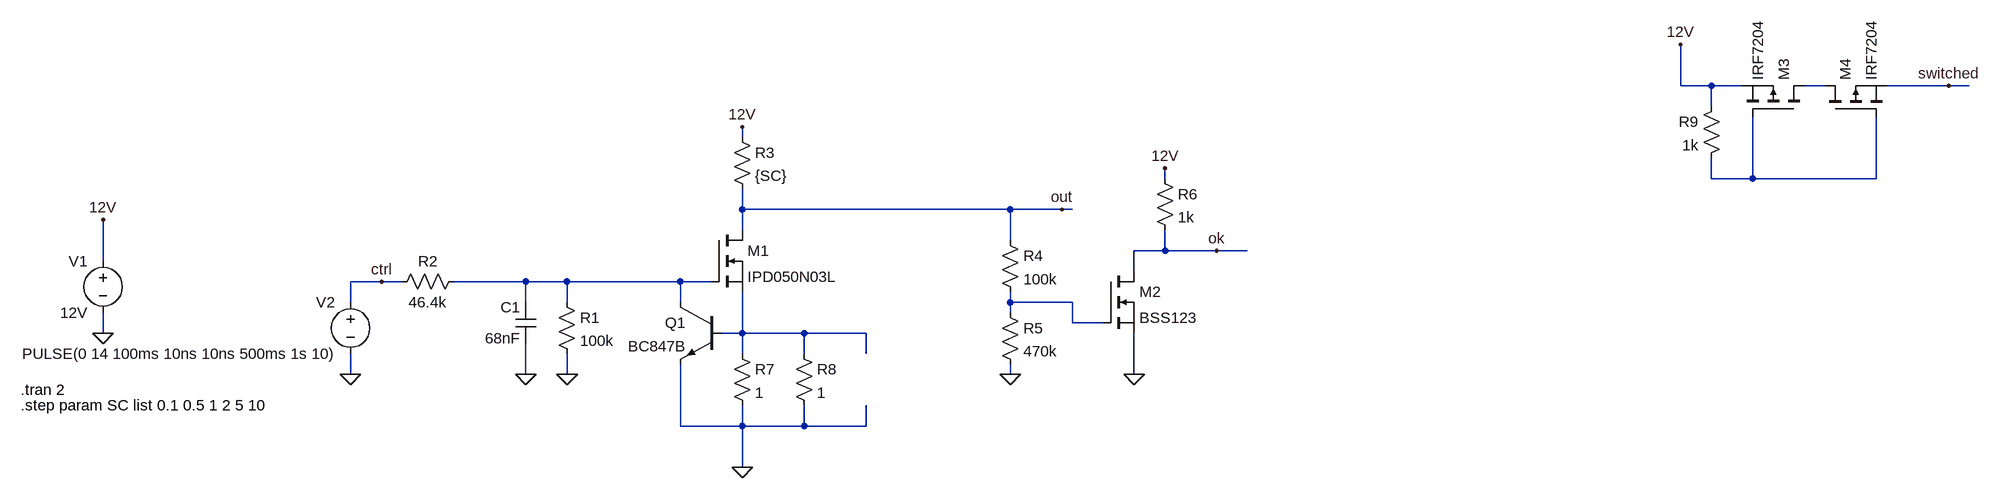
[diagram p0: schematic Current Regulation.asc]
Current Regulation.asc, the LTspice schematic file:
Version 4
SHEET 1 3156 680
WIRE 2672 -128 2672 -192
WIRE 2720 -128 2672 -128
WIRE 2768 -128 2720 -128
WIRE 2896 -128 2864 -128
WIRE 3088 -128 2992 -128
WIRE 3120 -128 3088 -128
WIRE 2720 -96 2720 -128
WIRE 1216 -48 1216 -64
WIRE 1872 16 1872 0
WIRE 2720 16 2720 -16
WIRE 2784 16 2784 -80
WIRE 2784 16 2720 16
WIRE 2976 16 2976 -80
WIRE 2976 16 2784 16
WIRE 1216 64 1216 32
WIRE 1632 64 1216 64
WIRE 1712 64 1632 64
WIRE 1728 64 1712 64
WIRE 1216 96 1216 64
WIRE 1632 112 1632 64
WIRE 1872 128 1872 96
WIRE 1872 128 1824 128
WIRE 1952 128 1872 128
WIRE 2000 128 1952 128
WIRE 224 144 224 80
WIRE 1824 160 1824 128
WIRE 656 176 608 176
WIRE 688 176 656 176
WIRE 880 176 768 176
WIRE 944 176 880 176
WIRE 1120 176 944 176
WIRE 1168 176 1120 176
WIRE 608 208 608 176
WIRE 880 208 880 176
WIRE 944 208 944 176
WIRE 1120 208 1120 176
WIRE 1632 208 1632 192
WIRE 1728 208 1632 208
WIRE 1632 224 1632 208
WIRE 1728 240 1728 208
WIRE 1776 240 1728 240
WIRE 224 256 224 224
WIRE 1216 256 1216 192
WIRE 1216 256 1184 256
WIRE 1312 256 1216 256
WIRE 1408 256 1312 256
WIRE 1216 288 1216 256
WIRE 1312 288 1312 256
WIRE 1408 288 1408 256
WIRE 608 320 608 288
WIRE 880 320 880 272
WIRE 944 320 944 288
WIRE 1632 320 1632 304
WIRE 1824 320 1824 256
WIRE 1120 400 1120 304
WIRE 1216 400 1216 368
WIRE 1216 400 1120 400
WIRE 1312 400 1312 368
WIRE 1312 400 1216 400
WIRE 1408 400 1408 368
WIRE 1408 400 1312 400
WIRE 1216 464 1216 400
FLAG 224 256 0
FLAG 224 80 12V
FLAG 880 320 0
FLAG 944 320 0
FLAG 1216 464 0
FLAG 608 320 0
FLAG 1216 -64 12V
FLAG 656 176 ctrl
FLAG 1712 64 out
FLAG 1632 320 0
FLAG 1824 320 0
FLAG 1952 128 ok
FLAG 1872 0 12V
FLAG 2672 -192 12V
FLAG 3088 -128 switched
SYMBOL voltage 224 128 M0
SYMATTR InstName V1
SYMATTR Value 12V
SYMBOL nmos 1168 96 R0
SYMATTR InstName M1
SYMATTR Value IPD050N03L
SYMBOL res 928 192 R0
SYMATTR InstName R1
SYMATTR Value 100k
SYMBOL res 784 160 R90
WINDOW 0 0 56 VBottom 2
WINDOW 3 32 56 VTop 2
SYMATTR InstName R2
SYMATTR Value 46.4k
SYMBOL cap 896 208 M0
SYMATTR InstName C1
SYMATTR Value 68nF
SYMBOL voltage 608 192 M0
WINDOW 123 0 0 Left 2
WINDOW 39 0 0 Left 2
SYMATTR InstName V2
SYMATTR Value PULSE(0 14 100ms 10ns 10ns 500ms 1s 10)
SYMBOL res 1200 -64 R0
SYMATTR InstName R3
SYMATTR Value {SC}
SYMBOL res 1616 96 R0
SYMATTR InstName R4
SYMATTR Value 100k
SYMBOL res 1616 208 R0
SYMATTR InstName R5
SYMATTR Value 470k
SYMBOL nmos 1776 160 R0
SYMATTR InstName M2
SYMATTR Value BSS123
SYMBOL res 1856 0 R0
SYMATTR InstName R6
SYMATTR Value 1k
SYMBOL res 1200 272 R0
SYMATTR InstName R7
SYMATTR Value 1
SYMBOL npn 1184 208 M0
SYMATTR InstName Q1
SYMATTR Value BC847B
SYMBOL res 1296 272 R0
SYMATTR InstName R8
SYMATTR Value 1
SYMBOL pmos 2864 -80 M270
SYMATTR InstName M3
SYMATTR Value IRF7204
SYMBOL res 2736 -112 M0
SYMATTR InstName R9
SYMATTR Value 1k
SYMBOL pmos 2896 -80 R270
SYMATTR InstName M4
SYMATTR Value IRF7204
TEXT 96 344 Left 2 !.tran 2
TEXT 96 368 Left 2 !.step param SC list 0.1 0.5 1 2 5 10

The netlist it stands for:
* Current Regulation.asc
V1 12V 0 12V
M1 out N003 N005 N005 IPD050N03L
R1 N003 0 100k
R2 N003 ctrl 46.4k
C1 N003 0 68nF
V2 ctrl 0 PULSE(0 14 100ms 10ns 10ns 500ms 1s 10)
R3 12V out {SC}
R4 out N004 100k
R5 N004 0 470k
M2 ok N004 0 0 BSS123
R6 12V ok 1k
R7 N005 0 1
Q1 N003 N005 0 0 BC847B
R8 N005 0 1
M3 N001 N002 12V 12V IRF7204
R9 12V N002 1k
M4 N001 N002 switched switched IRF7204
.model NPN NPN
.model PNP PNP
.lib standard.bjt
.model NMOS NMOS
.model PMOS PMOS
.lib standard.mos
.tran 2
.step param SC list 0.1 0.5 1 2 5 10
.backanno
.end